# EAGLE design ESP-01_prog_v1_0 (EAGLE 9.6.2)
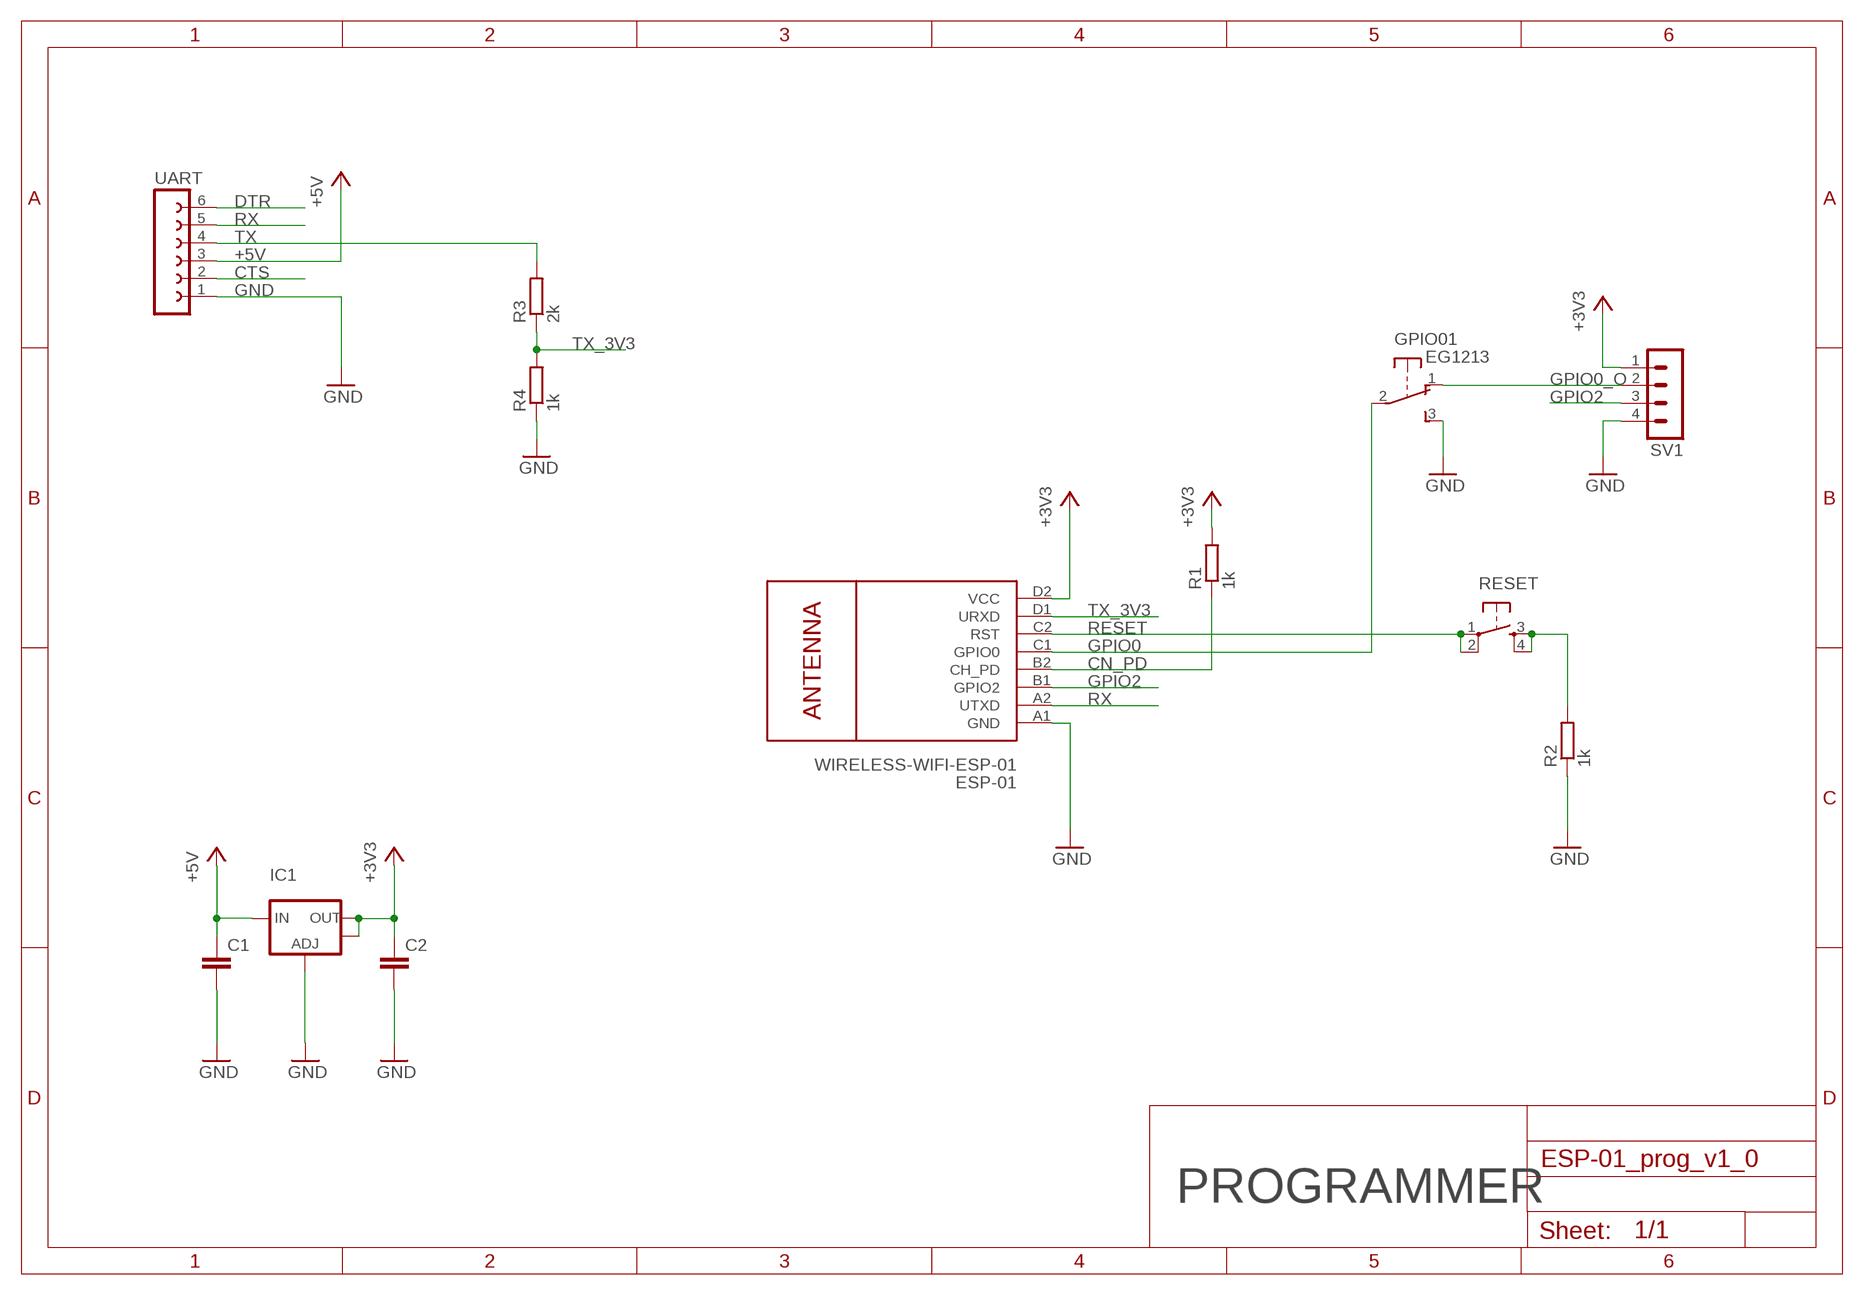
[diagram p0: schematic, sheet 1]

## Parts
C1  C-EUC0603  [C0603]
C2  C-EUC0603  [C0603]
ESP-01  WIRELESS-WIFI-ESP-01  [WIRELESS-WIFI-ESP-01]
GPIO0  EG1213  [EG1213]
IC1  LM1117SOT223  [SOT223]
R1  1k  R-EU_R0603  [R0603]
R2  1k  R-EU_R0603  [R0603]
R3  2k  R-EU_R0603  [R0603]
R4  1k  R-EU_R0603  [R0603]
RESET  TAC_SWITCHPTH  [TACTILE-PTH]
SV1  MA04-1  [MA04-1]
UART  FE06-1  [FE06]

## Nets
+3V3: C2.1 ESP-01.D2(VCC) IC1.2(OUT) IC1.4(OUT) R1.2 SV1.1
+5V: C1.1 IC1.3(IN) UART.3
CN_PD: ESP-01.B2(CH_PD) R1.1
CTS: UART.2
DTR: UART.6
GND: C1.2 C2.2 ESP-01.A1(GND) GPIO0.3(1:S) IC1.1(ADJ) R2.1 R4.1 SV1.4 UART.1
GPIO0: ESP-01.C1(GPIO0) GPIO0.2(1:P)
GPIO0_O: GPIO0.1(1:O) SV1.2
GPIO2: ESP-01.B1(GPIO2) SV1.3
N$1: R2.2 RESET.3 RESET.4
RESET: ESP-01.C2(RST) RESET.1 RESET.2
RX: ESP-01.A2(UTXD) UART.5
TX: R3.2 UART.4
TX_3V3: ESP-01.D1(URXD) R3.1 R4.2
Unconnected: GPIO0.MT1(MT) GPIO0.MT2(MT)

## Notes on the sheet
- PROGRAMMER

## Library data of the parts
C1 C2 = rcl:C-EU: CAPACITOR, European symbol; SPICEPREFIX: C
ESP-01 = acs712:WIRELESS-WIFI-ESP-01: Wireless Wi-Fi ESP-01 Module based on ESP8266 chip Click here to find device on ebay.com <http://www.ebay.com/sch/esp8266+esp+01+transceiver>
GPIO0 = adafruit:EG1213: E-Switch right-angle slide SPDT Part #EG1213 http://www.ladyada.net/library/eagle
IC1 = 23K_candrian:LM1117
R1-R4 = rcl:R-EU_: RESISTOR, European symbol; SPICEPREFIX: R
RESET = SparkFun-Retired:TAC_SWITCH: Momentary Switch Button commonly used for reset or general input. Spark Fun Electronics SKU : COM-00097 SMT- SWCH-08247
SV1 = con-lstb:MA04-1: PIN HEADER; OC_FARNELL: unknown; OC_NEWARK: unknown
UART = con-lsta:FE06-1: FEMALE HEADER; OC_FARNELL: unknown; OC_NEWARK: unknown

## Board
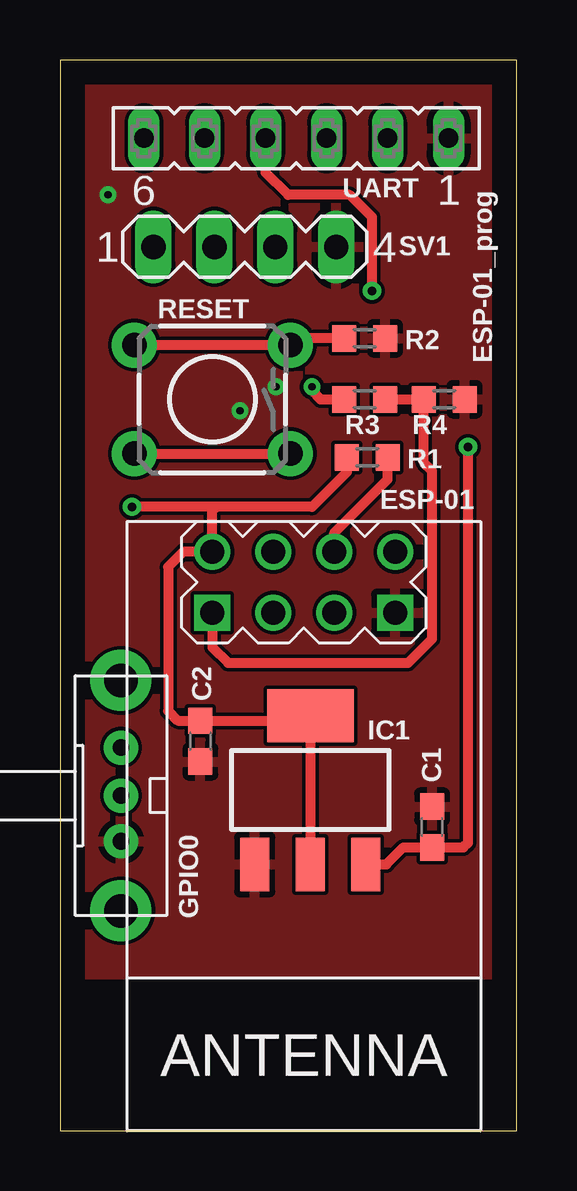
[diagram p1: board, top side]
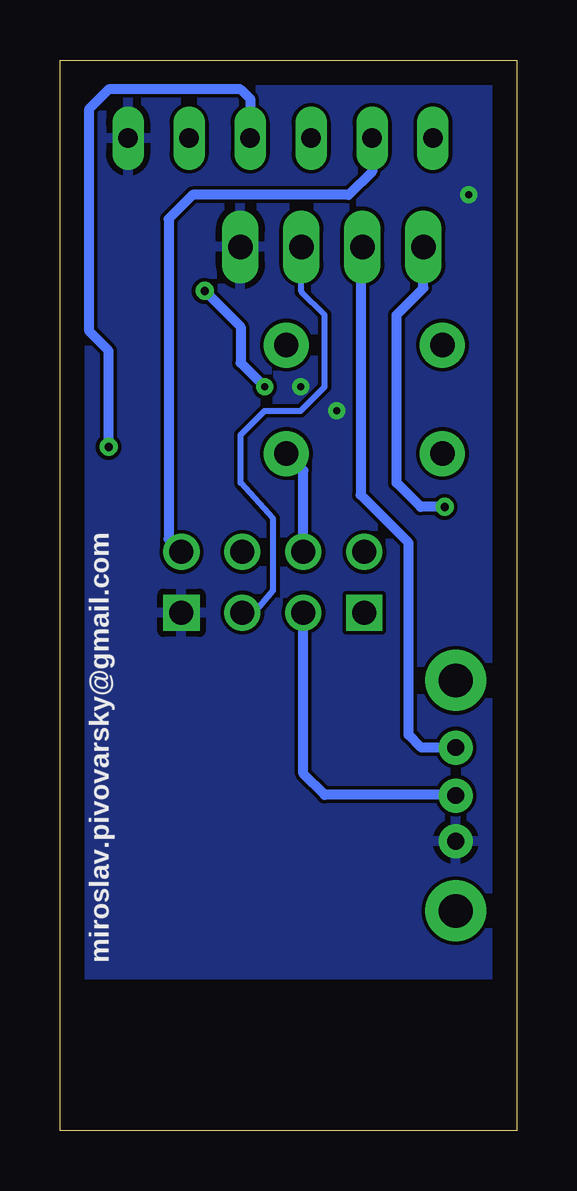
[diagram p2: board, bottom side, seen from below]

Size 19.03 x 44.62 mm. Coordinates in mm from the lower left corner, seen from the top.
Outline: 0,0 19.03,0 19.03,44.62 0,44.62 0,0
Copper layers (1*16): Top 0.035mm / dielectric 1.5mm / Bottom 0.035mm
Design rules "default *": minimum track width 6mil, minimum drill 0.35mm, track to track 6mil, track to pad 6mil, pad to pad 6mil, via to via 6mil, smd to smd 6mil, copper to edge 40mil, drill to drill 6mil, minimum pad ring 10mil, minimum via ring 8mil, stop-mask expansion 4mil, vias tented up to drill 30mil, thermal gap 10mil

### Footprints (pad centres in the part's own frame; a part is rotated, then mirrored left to right if it is on the bottom)
C0603 = smd 1.1 x 1: 1 -0.85,0; 2 0.85,0
WIRELESS-WIFI-ESP-01 = drill 1 square: A1 -8.89,3.81; D1 -8.89,-3.81 | drill 1: A2 -11.43,3.81; B1 -8.89,1.27; B2 -11.43,1.27; C1 -8.89,-1.27; C2 -11.43,-1.27; D2 -11.43,-3.81
EG1213 = drill 0.7 pad 1.422: 1 -2,0; 2 0,0; 3 1.9,0 | drill 1.4 pad 2.54: MT1 -4.8,0; MT2 4.8,0
SOT223 = smd 1.219 x 2.235: 1 -2.311,-3.099; 2 0,-3.099; 3 2.311,-3.099 | smd 3.6 x 2.2: 4 0,3.099
R0603 = smd 1 x 1.1: 1 -0.85,0; 2 0.85,0
TACTILE-PTH = drill 1.016 pad 1.88: 1 -3.251,2.261; 2 3.251,2.261; 3 -3.251,-2.261; 4 3.251,-2.261
MA04-1 = drill 1.016 long: 1 -3.81,0; 2 -1.27,0; 3 1.27,0; 4 3.81,0
FE06 = drill 0.813 long: 1 -6.35,0; 2 -3.81,0; 3 -1.27,0; 4 1.27,0; 5 3.81,0; 6 6.35,0

### Placement (x,y rotation side)
C1  15.51,12.66 90 top
C2  5.85,16.24 270 top
ESP-01  10.16,12.7 270 top
GPIO0  2.54,13.97 270 top
IC1  10.43,14.2 0 top
R1  12.8,28.06 180 top
R2  12.7,33.02 180 top
R3  12.7,30.48 180 top
R4  16.01,30.48 180 top
RESET  6.35,30.48 180 top
SV1  7.7,36.83 0 top
UART  9.84,41.36 180 top

### Tracks (layer width: path | path; a pad name or v marks a point on that pad's centre or on a via)
+3V3  (via drill 0.35)
  Top 0.406: 6.5,26 6.35,25.85 ESP-01.D2 5.13,24.13 4.5,23.5 4.5,17.5 4.91,17.09 C2.1 10.22,17.09 IC1.4 IC1.2 | 6.5,26 10.5,26 11.95,27.45 R1.2 | 6.5,26 v3,26
  Bottom 0.406: v3,26 4,26 5,27 5,34 3.89,35.11 SV1.1
+5V  (via drill 0.35)
  Top 0.406: v17,28.5 17,12 16.81,11.81 C1.1 14.31,11.81 13.6,11.1 IC1.3
  Bottom 0.406: v17,28.5 17,32.5 17.81,33.31 17.81,42.59 17,43.4 11.5,43.4 11.11,43.01 UART.3
CN_PD
  Top 0.406: ESP-01.B2 11.43,24.93 13.65,27.15 R1.1
GND  (via drill 0.3)
  other vias: 9,31 2,39 7.5,30
  pour Top: 0,6.5 0,44.5 19,44.5 19,6.5
  pour Bottom: 0,44.5 0,6.5 19,6.5 19,44.5
GPIO0
  Bottom 0.406: GPIO0.2 2.57,14 8,14 8.89,14.89 ESP-01.C1
GPIO0_O
  Bottom 0.406: GPIO0.1 3.97,15.97 4.5,16.5 4.5,24.5 6.5,26.5 6.5,36.76 SV1.2
GPIO2
  Bottom 0.254: ESP-01.B1 10.93,21.59 10.15,22.52 10.15,25.5 11.5,27 11.5,29 10.5,30 9,30 8,31 8,34 8.97,34.97 SV1.3
N$1
  Top 0.406: RESET.4 RESET.3 9.88,33.02 R2.2
RESET
  Top 0.406: RESET.2 RESET.1
  Bottom 0.406: ESP-01.C2 8.89,27.51 RESET.1
RX
  Bottom 0.406: UART.5 6.03,39.97 7,39 13.5,39 14.5,38 14.5,24.66 ESP-01.A2
TX  (via drill 0.3, 0.35)
  Top 0.406: R3.2 10.85,30.48 10.5,30.83 v10.5,31 | v13,35 13,38.07 12.07,39 9.5,39 8.57,39.93 UART.4
  Bottom 0.406: v13,35 11.5,33.5 11.5,32 v10.5,31
TX_3V3
  Top 0.406: R3.1 R4.2 15.16,27.84 15.5,27.5 15.5,20.5 14.5,19.5 7,19.5 6.35,20.15 ESP-01.D1

### Text on the board
tNames: ESP-01_prog
bNames: miroslav.pivovarsky@gmail.com